# EAGLE design Transceivers_Ver2 (EAGLE 7.1.0)
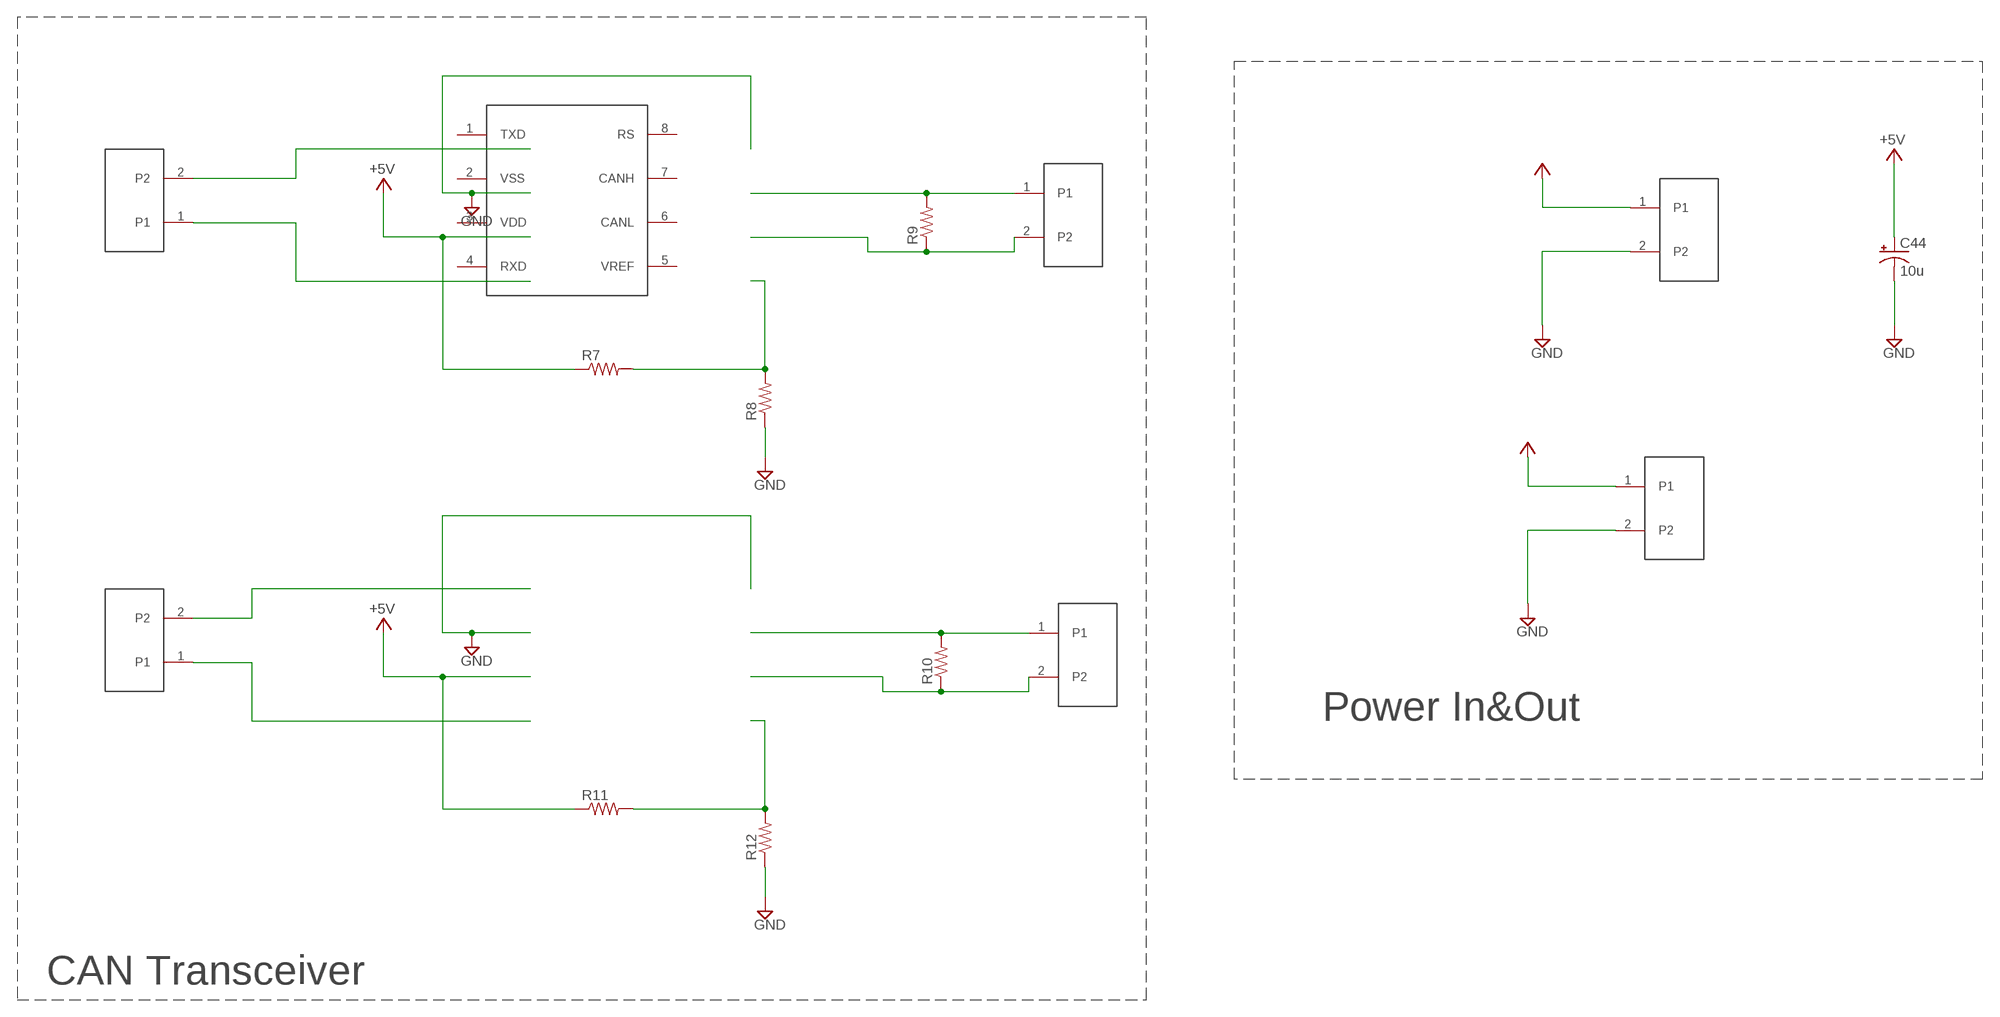
[diagram p0: schematic, sheet 1]

## Parts
C44  10u  CPOL-US153CLV-0405  [153CLV-0405]
CAN0  CON-100MIL  [2X1-100MIL]
CAN1  CON-100MIL  [2X1-100MIL]
POWER  CON-100MIL  [2X1-100MIL]
POWER1  CON-100MIL  [2X1-100MIL]
R7  R-US_R0805  [R0805]
R8  R-US_R0805  [R0805]
R9  R-US_R0805  [R0805]
R10  R-US_R0805  [R0805]
R11  R-US_R0805  [R0805]
R12  R-US_R0805  [R0805]
TXRX0  CON-100MIL  [2X1-100MIL]
TXRX1  CON-100MIL  [2X1-100MIL]
U$1  MCP2551-DIP  [DIL08]

## Nets
+5V: C44.+ POWER1.1 POWER.1 R7.1 R11.1
CH0: CAN0.1 R9.2
CH1: CAN1.1 R10.2
CL0: CAN0.2 R9.1
CL1: CAN1.2 R10.1
GND: C44.- POWER1.2 POWER.2 R8.1 R12.1
N$3: R7.2 R8.2
N$7: R11.2 R12.2
RX0: TXRX0.1
RX1: TXRX1.1
TX0: TXRX0.2
TX1: TXRX1.2
Unconnected: U$1.1(TXD) U$1.2(VSS) U$1.3(VDD) U$1.4(RXD) U$1.5(VREF) U$1.6(CANL) U$1.7(CANH) U$1.8(RS)

## Notes on the sheet
- Power In&Out
- CAN Transceiver

## Library data of the parts
C44 = Dash parts:CPOL-US: POLARIZED CAPACITOR, American symbol; EEE-FPV100UAR: 10u
CAN0 CAN1 POWER POWER1 TXRX0 TXRX1 = Dash parts:CON-100MIL
R7-R12 = resistor:R-US_: RESISTOR, American symbol
U$1 = Dash parts:MCP2551-DIP

## Net classes
0 default: width 0.203 mm, drill 0.406 mm, clearance 0.203 mm
3 usbvcc: width 0.203 mm, drill 0.406 mm, clearance 0.203 mm
4 USBpair: width 0.254 mm, drill 0.406 mm, clearance 0.61 mm

## Board
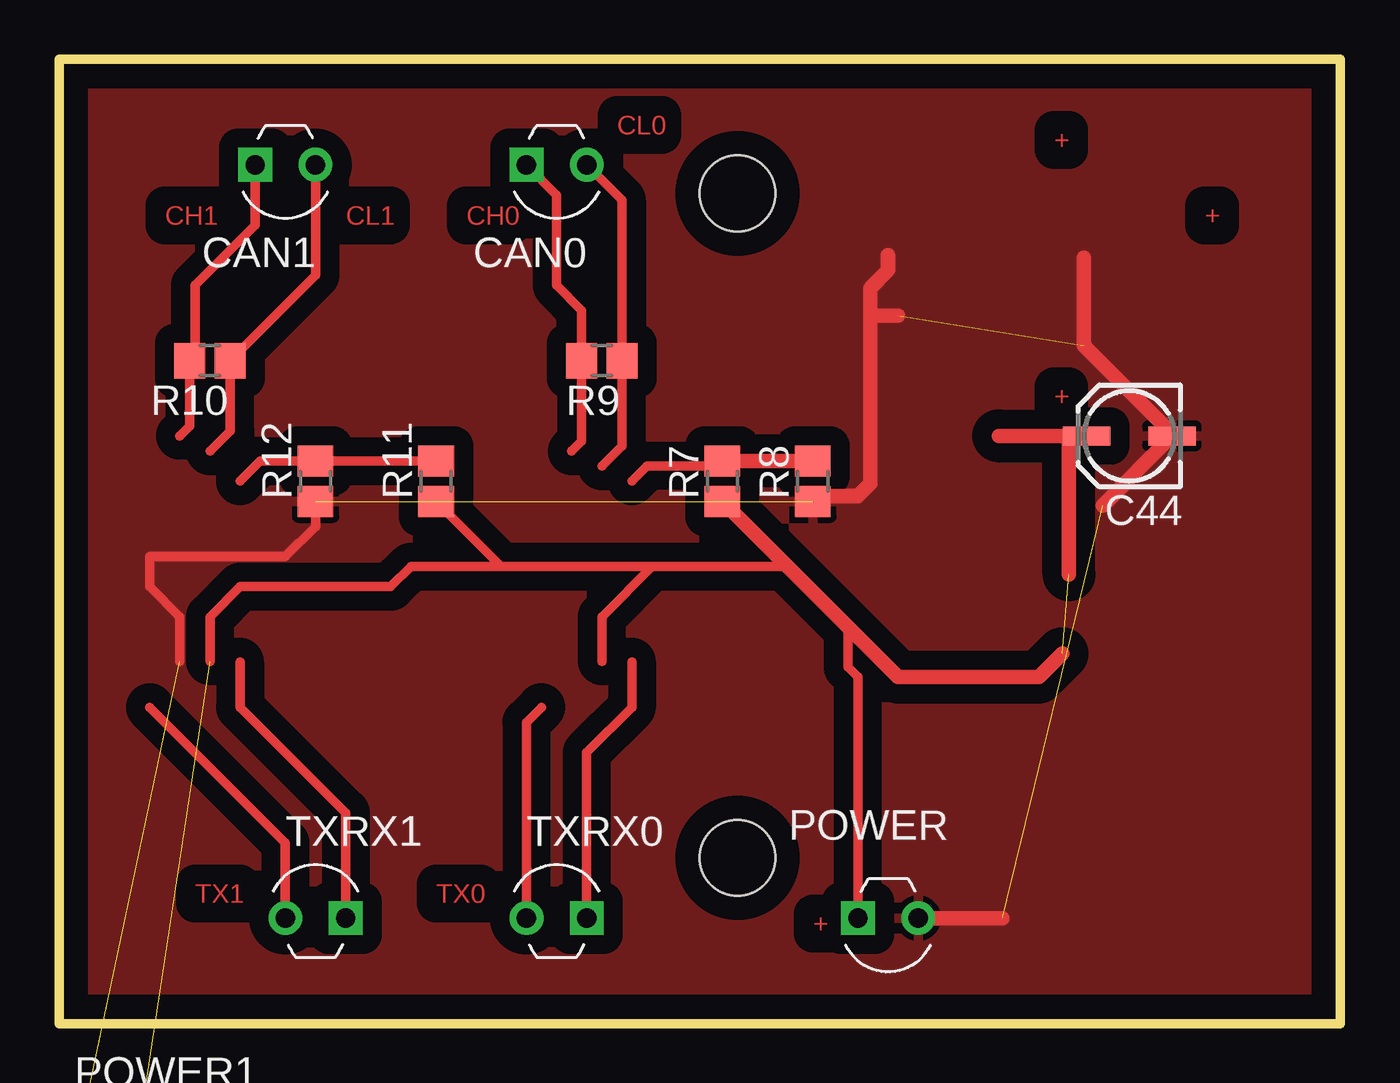
[diagram p1: board, top side]

Size 53.98 x 40.64 mm. Coordinates in mm from the lower left corner, seen from the top.
Outline: 0,0 0,40.64 53.98,40.64 53.98,0 0,0
Copper layers (1*16): Top 0.035mm / dielectric 1.5mm / Bottom 0.035mm
Design rules "default": minimum track width 10mil, minimum drill 24mil, track to track 8mil, track to pad 8mil, pad to pad 8mil, via to via 8mil, smd to smd 8mil, copper to edge 40mil, drill to drill 8mil, minimum pad ring 10mil, minimum via ring 8mil, stop-mask expansion 4mil, vias tented up to drill 0mil, thermal gap 10mil
Holes 3.2 mm at 28.57,6.98 28.57,34.98

### Footprints (pad centres in the part's own frame; a part is rotated, then mirrored left to right if it is on the bottom)
153CLV-0405 = smd 2 x 0.8: + 1.8,0; - -1.8,0
2X1-100MIL = drill 0.813 pad 1.422 square: 1 2.54,-1.27 | drill 0.813 pad 1.422: 2 0,-1.27
R0805 = smd 1.3 x 1.5: 1 -0.85,0; 2 0.85,0
DIL08 = drill 0.813 long: 1 -3.81,-3.81; 2 -1.27,-3.81; 3 1.27,-3.81; 4 3.81,-3.81; 5 3.81,3.81; 6 1.27,3.81; 7 -1.27,3.81; 8 -3.81,3.81

### Placement (x,y rotation side)
C44  45.09,24.77 180 top
CAN0  22.23,34.92 180 top
CAN1  10.79,34.92 180 top
POWER  36.2,3.18 180 top
POWER1  0.64,-4.45 0 top  (outside the outline)
R7  27.94,22.86 90 top
R8  31.75,22.86 90 top
R9  22.86,27.94 180 top
R10  6.35,27.94 180 top
R11  15.88,22.86 90 top
R12  10.79,22.86 90 top
TXRX0  19.68,5.71 0 top
TXRX1  9.53,5.71 0 top
U$1  6.99,-15.88 0 top  (outside the outline)

### Tracks (layer width: path | path; a pad name or v marks a point on that pad's centre or on a via)
+5V  (2 unrouted)
  Top 0.406: 22.86,15.27 22.86,17.14 24.98,19.26 | 24.98,19.26 30.69,19.26 | R11.1 18.63,19.26 | 18.63,19.26 24.98,19.26 | 6.35,15.27 6.35,17.14 7.62,18.41 13.97,18.41 14.82,19.26 18.63,19.26 | POWER.1 33.66,14.61 33.23,15.03 33.23,16.72
  Top 0.61: 39.59,24.77 42.55,24.77 | 42.55,24.77 C44.+ 43.82,24.77 | R7.1 30.69,19.26 33.23,16.72 35.34,14.61 41.28,14.61 42.27,15.59 | 42.55,18.92 42.55,24.77
CH0
  Top 0.406: CAN0.1 20.96,34.92 20.96,31.12 22.01,30.06 R9.2 22.01,24.55 21.59,24.13
CH1
  Top 0.406: 5.08,24.77 5.5,25.19 R10.2 5.71,28.16 5.71,31.12 8.25,33.66 CAN1.1
CL0
  Top 0.406: CAN0.2 23.71,34.71 23.71,28.57 R9.1 23.71,24.34 22.86,23.49
CL1
  Top 0.406: 6.35,24.13 7.2,24.98 R10.1 10.79,31.53 CAN1.2
GND  (4 unrouted)
  Top 0.406: R8.1 31.96,22.23 | 5.08,15.27 5.08,17.14 3.81,18.41 3.81,19.69 9.53,19.69 10.79,20.95 R12.1
  Top 0.61: 31.96,22.23 33.66,22.23 34.18,22.75 34.18,29.84 | 34.18,29.84 34.18,31.01 34.93,31.75 34.93,32.38 | 43.97,21.84 C44.- 46.89,24.87 43.18,28.57 43.18,32.28 | 39.75,4.45 POWER.2 | 35.34,29.84 34.18,29.84
  pour Top (isolate 0.813): -0.63,41.27 53.98,41.27 53.98,-0.64 -0.63,-0.64
N$3
  Top 0.406: R7.2 27.73,23.49 24.77,23.49 24.13,22.86
  Top 0.61: R8.2 R7.2
N$7
  Top 0.406: R11.2 R12.2 8.47,23.71 7.62,22.86
RX0
  Top 0.406: 24.13,15.25 24.13,13.34 22.23,11.43 TXRX0.1
RX1
  Top 0.406: 7.62,15.25 7.62,13.34 12.07,8.89 TXRX1.1
TX0
  Top 0.406: 20.32,13.34 19.68,12.7 TXRX0.2
TX1
  Top 0.406: 3.81,13.34 9.53,7.62 TXRX1.2

### Text on the board
Top: CL0 | + | CH1 | CL1 | CH0 | + | + | TX1 | TX0 | +